# Altium schematic sheet HID.SchDoc
size A4; SheetNumber: 6; SheetTotal: 10
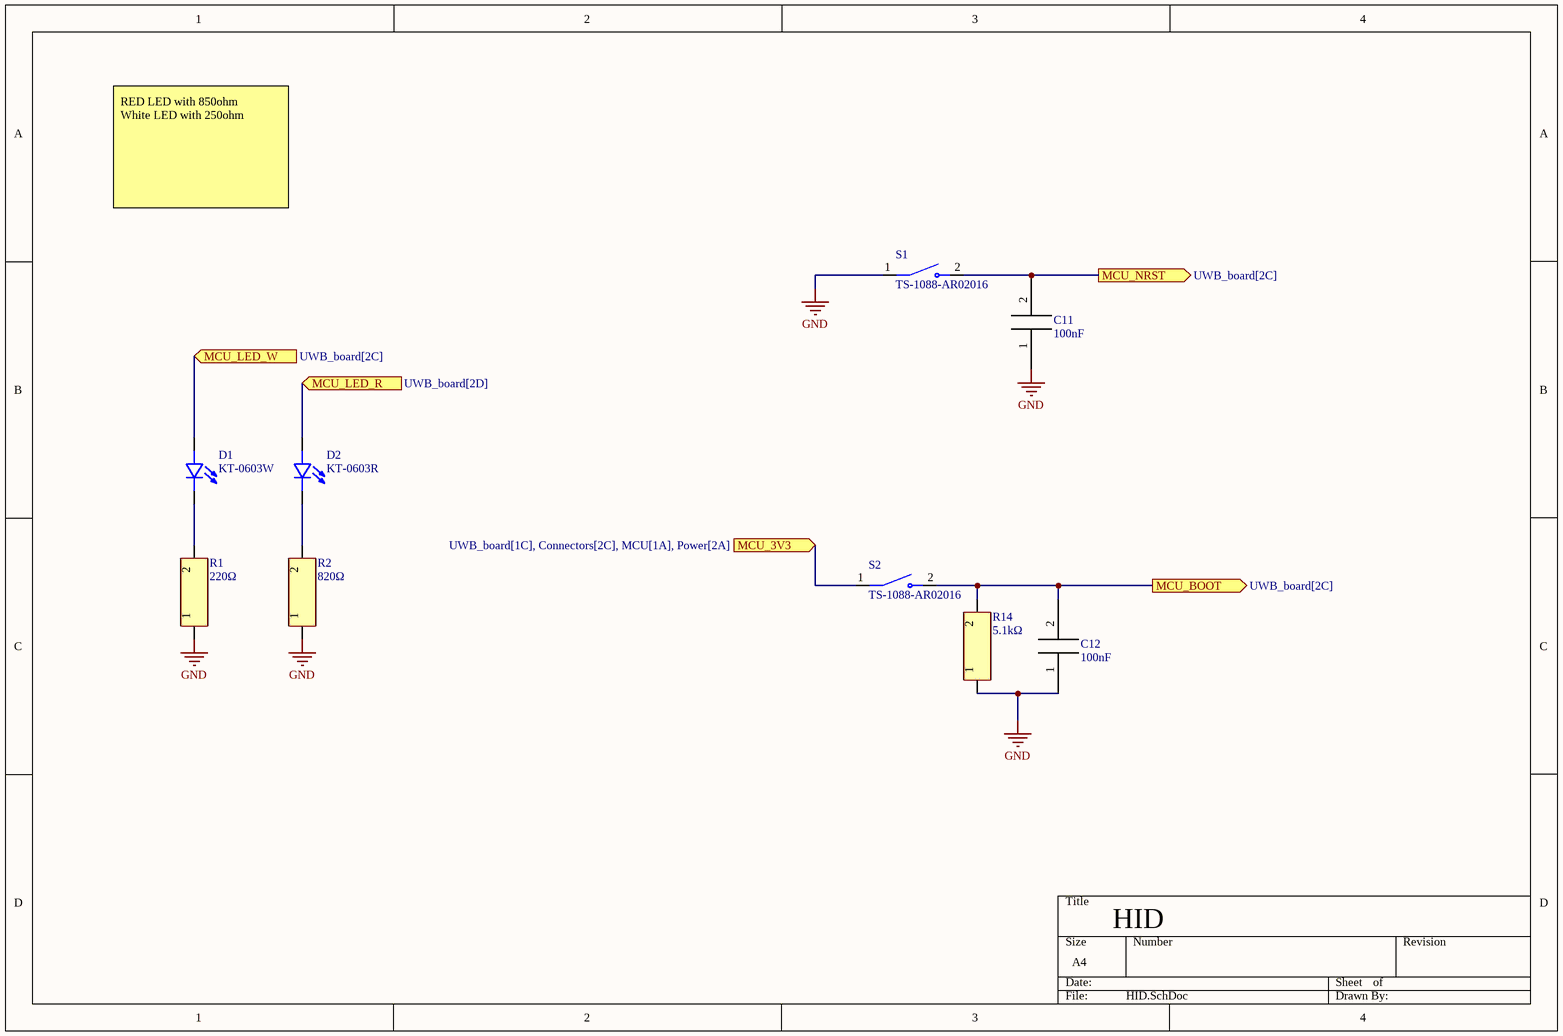
[diagram p0: HID.SchDoc]

## Parts
C11  100nF  [0603_cap]
C12  100nF  [0603_cap]
D1  KT-0603W  [0603_LED]
D2  KT-0603R  [0603_LED]
R1  value 220Ω  [0603_res]  (hidden comment: 220)
R2  value 820Ω  [0603_res]  (hidden comment: 820)
R14  value 5.1kΩ  [0603_res]  (hidden comment: 5.1k)
S1  TS-1088-AR02016  [SW_TS-1088-AR02016]
S2  TS-1088-AR02016  [SW_TS-1088-AR02016]

## Ports
MCU_3V3 (in, see UWB_board[1C], Connectors[2C], MCU[1A], Power[2A]), MCU_BOOT (out, see UWB_board[2C]), MCU_LED_R (in, see UWB_board[2D]), MCU_LED_W (in, see UWB_board[2C]), MCU_NRST (out, see UWB_board[2C])

## Nets
GND: C11.1 C12.1 R1.1 R2.1 R14.1 S1.1
MCU_3V3: S2.1 ; port MCU_3V3
MCU_BOOT: C12.2 R14.2 S2.2 ; port MCU_BOOT
MCU_LED_R: D2.A ; port MCU_LED_R
MCU_LED_W: D1.A ; port MCU_LED_W
MCU_NRST: C11.2 S1.2 ; port MCU_NRST
NetD1_C: D1.C R1.2
NetD2_C: D2.C R2.2

## Notes on the sheet
- RED LED with 850ohm
  White LED with 250ohm
- HID

## Library data of the parts
C11 C12 = CC0603KRX7R9BB104: 100nF 50V X7R ±10% 0603 Multilayer Ceramic Capacitors MLCC - SMD/SMT ROHS; LCSC Part #: C14663; Value: 100nF
D1 = KT-0603W: 100mW 120° 2.6V~3.1V 360mcd 5mA Discrete Diode White Yellow Lens op View Mount 0603 LED Indication - Discrete ROHS; LCSC Part #: C2290
D2 = KT-0603R: -40℃~+85℃ 120° 2.4V 20mA 300mcd 40mW 615nm~630nm 645nm Red Water Clear 0603 LED Indication - Discrete ROHS; LCSC Part #: C2286
R1 = 0603WAF2200T5E: 220Ω -55℃~+155℃ 100mW 75V Thick Film Resistor ±1% ±100ppm/℃ 0603 Chip Resistor - Surface Mount ROHS; LCSC Part #: C22962
R2 = 0603WAF8200T5E: 820Ω -55℃~+155℃ 100mW 75V Thick Film Resistor ±1% ±100ppm/℃ 0603 Chip Resistor - Surface Mount ROHS; LCSC Part #: C23253
R14 = 0603WAF5101T5E: 5.1kΩ -55℃~+155℃ 100mW 75V Thick Film Resistor ±1% ±100ppm/℃ 0603 Chip Resistor - Surface Mount ROHS; LCSC Part #: C23186
S1 S2 = TS-1088-AR02016: 50mA 4mm 100MÎ© 100,000 Times 12V 160gf 3mm 2mm Round Button Vertical welding SPST SMD Tactile Switches ROHS; LCSC Part #: C720477